# Altium schematic sheet 06-LORA.SchDoc: LoRa
size A4; DocumentNumber: 6; SheetNumber: 6; SheetTotal: 8
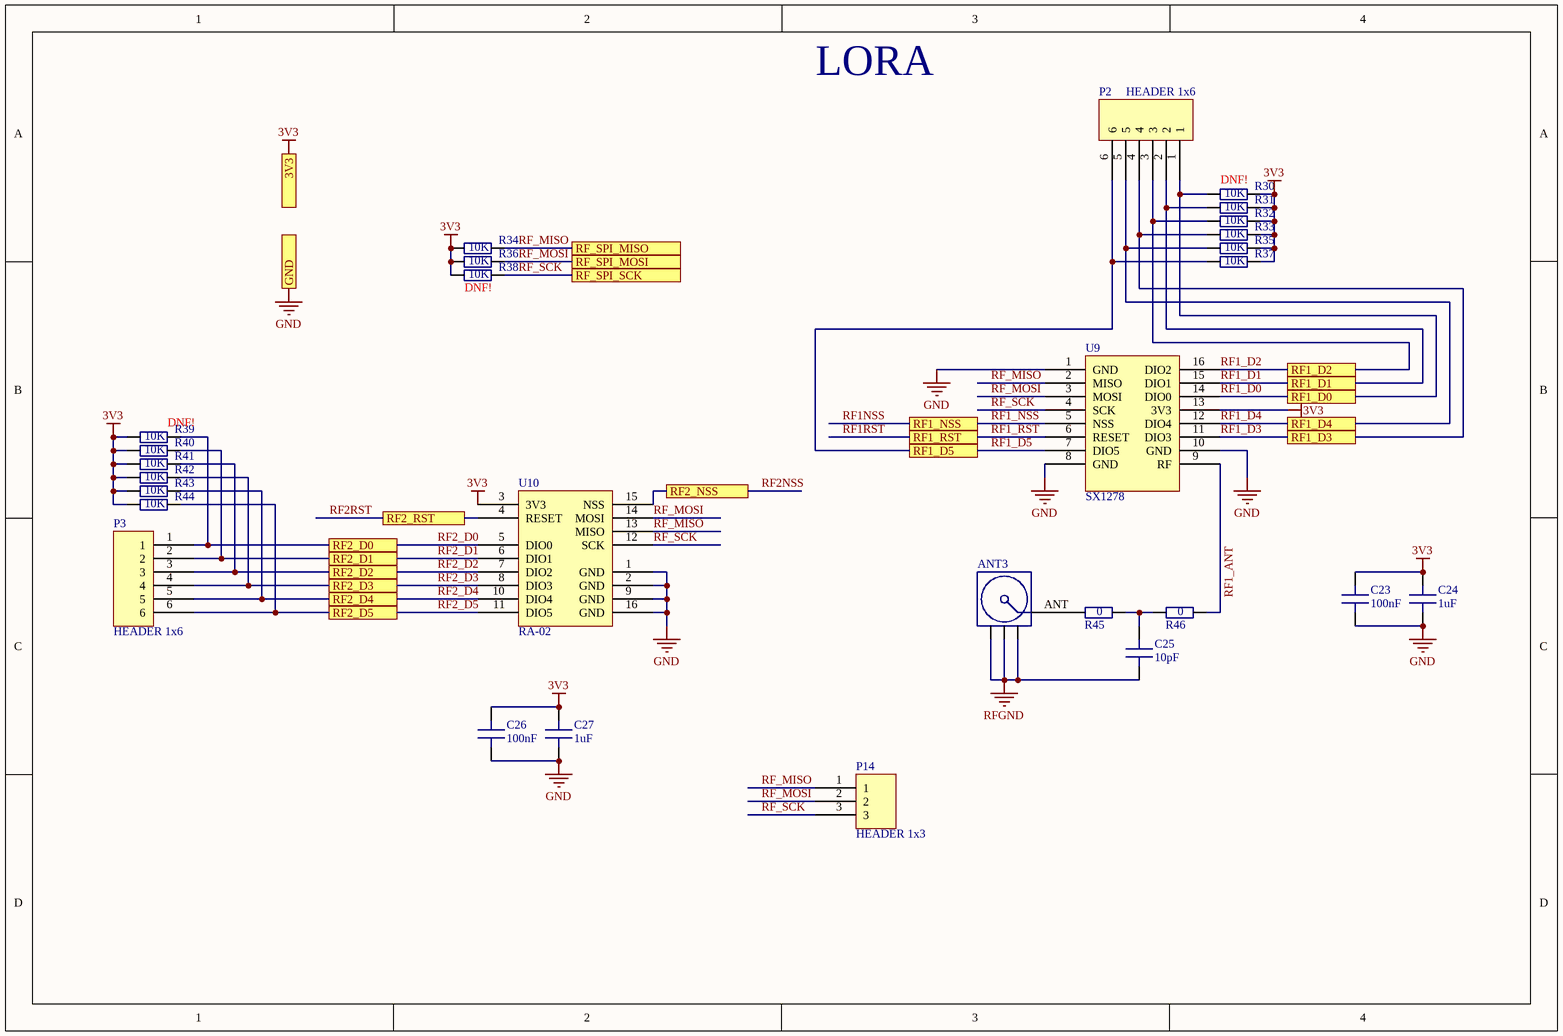
[diagram p0: 06-LORA.SchDoc]

## Parts
ANT3  UFL  [U.FL CONNECTOR]  (value not drawn)
C23  100nF  [C0603]
C24  1uF  [C0805]
C25  10pF  [C0402]
C26  100nF  [C0603]
C27  1uF  [C0805]
P2  HEADER 1x6  [HEADER 1x6 2.54]
P3  HEADER 1x6  [HEADER 1x6 2.54]
P14  HEADER 1x3  [UART_2.54]
R30  Resistance: 10K  [R0603]
R31  Resistance: 10K  [R0603]
R32  Resistance: 10K  [R0603]
R33  Resistance: 10K  [R0603]
R34  Resistance: 10K  [R0603]
R35  Resistance: 10K  [R0603]
R36  Resistance: 10K  [R0603]
R37  Resistance: 10K  [R0603]
R38  Resistance: 10K  [R0603]
R39  Resistance: 10K  [R0603]
R40  Resistance: 10K  [R0603]
R41  Resistance: 10K  [R0603]
R42  Resistance: 10K  [R0603]
R43  Resistance: 10K  [R0603]
R44  Resistance: 10K  [R0603]
R45  Resistance: 0  [R0402]
R46  Resistance: 0  [R0402]
U9  SX1278  [SX1278]
U10  RA-02  [RA-02]

## Ports
3V3 (out), GND, RF1_D0, RF1_D1, RF1_D2, RF1_D3, RF1_D4, RF1_D5, RF1_NSS, RF1_RST, RF2_D0, RF2_D1, RF2_D2, RF2_D3, RF2_D4, RF2_D5, RF2_NSS, RF2_RST, RF_SPI_MISO, RF_SPI_MOSI, RF_SPI_SCK

## Nets
3V3: C23.2 C24.2 C26.2 C27.2 R30.2 R31.2 R32.2 R33.2 R34.1 R35.2 R36.1 R37.2 R38.1 R39.1 R40.1 R41.1 R42.1 R43.1 R44.1 U9.13(3V3) U10.3(3V3) ; port 3V3
GND: C23.1 C24.1 C26.1 C27.1 U9.1(GND) U9.8(GND) U9.10(GND) U10.1(GND) U10.2(GND) U10.9(GND) U10.16(GND) ; port GND
RFGND: ANT3.GND C25.1
RF1_ANT: R46.2 U9.9(RF)
RF1_D0: P2.1 R30.1 U9.14(DIO0) ; port RF1_D0
RF1_D1: P2.2 R31.1 U9.15(DIO1) ; port RF1_D1
RF1_D2: P2.3 R32.1 U9.16(DIO2) ; port RF1_D2
RF1_D3: P2.4 R33.1 U9.11(DIO3) ; port RF1_D3
RF1_D4: P2.5 R35.1 U9.12(DIO4) ; port RF1_D4
RF1_D5: P2.6 R37.1 U9.7(DIO5) ; port RF1_D5
RF1_NSS: U9.5(NSS) ; port RF1_NSS  [also labelled RF1NSS]
RF1_RST: U9.6(RESET) ; port RF1_RST  [also labelled RF1RST]
RF2_D0: P3.1 R39.2 U10.5(DIO0) ; port RF2_D0
RF2_D1: P3.2 R40.2 U10.6(DIO1) ; port RF2_D1
RF2_D2: P3.3 R41.2 U10.7(DIO2) ; port RF2_D2
RF2_D3: P3.4 R42.2 U10.8(DIO3) ; port RF2_D3
RF2_D4: P3.5 R43.2 U10.10(DIO4) ; port RF2_D4
RF2_D5: P3.6 R44.2 U10.11(DIO5) ; port RF2_D5
RF2NSS: U10.15(NSS) ; port RF2_NSS
RF2RST: U10.4(RESET) ; port RF2_RST
RF_MISO: P14.1 R34.2 U9.2(MISO) U10.13(MISO) ; port RF_SPI_MISO
RF_MOSI: P14.2 R36.2 U9.3(MOSI) U10.14(MOSI) ; port RF_SPI_MOSI
RF_SCK: P14.3 R38.2 U9.4(SCK) U10.12(SCK) ; port RF_SPI_SCK
NetANT3_ANT: ANT3.ANT(SIGNAL) R45.1
NetC25_2: C25.2 R45.2 R46.1

## Notes on the sheet
- LORA
- (near R30) DNF!
- (near R38) DNF!
- (near R39) DNF!

## Library data of the parts
ANT3 = ANT-U.FL: Generic U.FL connector with 1 ANT + 3 GND
C23 C26 = C0603_100nF_16V: Ceramic capacitor; Voltage: 16V; Capacity: 100nF; Size: 0603; Value: 100nF
C24 C27 = C0805_1uF_25V: Ceramic capacitor; Voltage: 25V; Capacity: 1uF; Size: 0805; Value: 1uF
C25 = C0402_10pF_50V: Ceramic capacitor; Voltage: 50V; Capacity: 10pF; Size: 0402; Value: 10pF
R30-R44 = R0603_10K: Resistor General; Tolerance: 5%; Size: 0603
R45 R46 = R0402_0R: Resistor General; Tolerance: *; Size: 0402
U9 = SX1278: SX1278 LoRa modem; Value: SX1278
U10 = RA-02: RA-02 LoRa modem by Ai-Thinker; Value: RA-02